# Altium schematic sheet NCS_wireless_display_connc_74hc595.SchDoc
size A
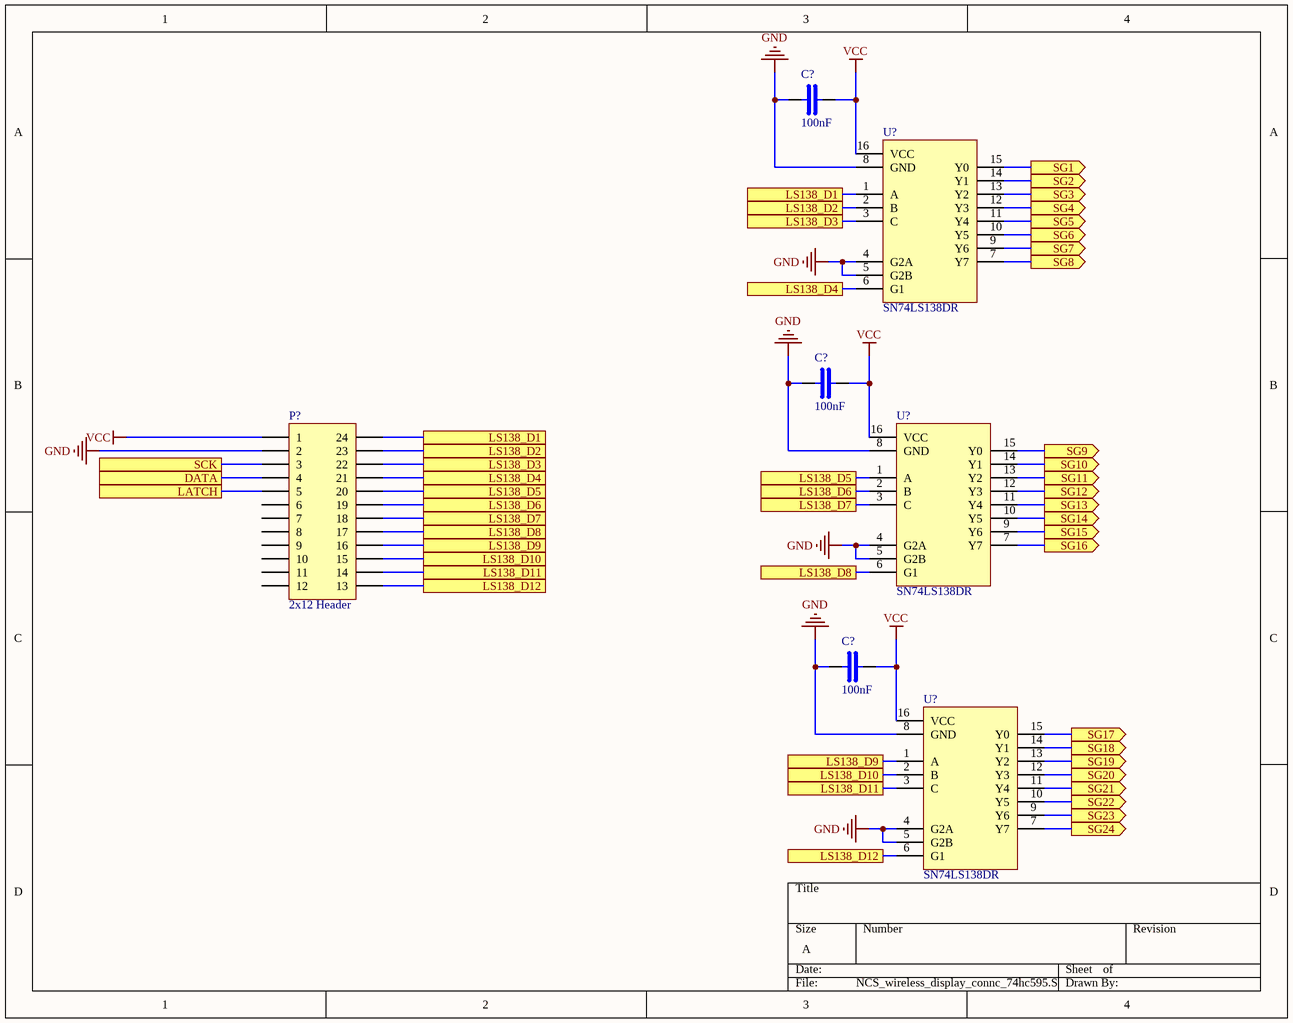
[diagram p0: NCS_wireless_display_connc_74hc595.SchDoc]

## Parts
(Parts that share a designator on the sheet are numbered #1, #2 ... from top to bottom, then left to right.)
C?#1  100nF  [C0805C104K3RACTU_100nF]
C?#2  100nF  [C0805C104K3RACTU_100nF]
C?#3  100nF  [C0805C104K3RACTU_100nF]
P?  2x12 Header  [2x12 header]
U?#1  SN74LS138DR  [SN74LS138DR_SOIC16]
U?#2  SN74LS138DR  [SN74LS138DR_SOIC16]
U?#3  SN74LS138DR  [SN74LS138DR_SOIC16]

## Ports
DATA, LATCH, LS138_D1, LS138_D2, LS138_D3, LS138_D4, LS138_D5, LS138_D6, LS138_D7, LS138_D8, LS138_D9, LS138_D10, LS138_D11, LS138_D12, SCK, SG1 (out), SG2 (out), SG3 (out), SG4 (out), SG5 (out), SG6 (out), SG7 (out), SG8 (out), SG9 (out), SG10 (out), SG11 (out), SG12 (out), SG13 (out), SG14 (out), SG15 (out), SG16 (out), SG17 (out), SG18 (out), SG19 (out), SG20 (out), SG21 (out), SG22 (out), SG23 (out), SG24 (out)

## Nets
GND: C?#1.1 C?#2.1 C?#3.1 P?.2 U?#1.4(G2A) U?#1.5(G2B) U?#1.8(GND) U?#2.4(G2A) U?#2.5(G2B) U?#2.8(GND) U?#3.4(G2A) U?#3.5(G2B) U?#3.8(GND)
VCC: C?#1.2 C?#2.2 C?#3.2 P?.1 U?#1.16(VCC) U?#2.16(VCC) U?#3.16(VCC)
DATA: P?.4 ; port DATA
LATCH: P?.5 ; port LATCH
LS138_D1: P?.24 U?#1.1(A) ; port LS138_D1
LS138_D2: P?.23 U?#1.2(B) ; port LS138_D2
LS138_D3: P?.22 U?#1.3(C) ; port LS138_D3
LS138_D4: P?.21 U?#1.6(G1) ; port LS138_D4
LS138_D5: P?.20 U?#2.1(A) ; port LS138_D5
LS138_D6: P?.19 U?#2.2(B) ; port LS138_D6
LS138_D7: P?.18 U?#2.3(C) ; port LS138_D7
LS138_D8: P?.17 U?#2.6(G1) ; port LS138_D8
LS138_D9: P?.16 U?#3.1(A) ; port LS138_D9
LS138_D10: P?.15 U?#3.2(B) ; port LS138_D10
LS138_D11: P?.14 U?#3.3(C) ; port LS138_D11
LS138_D12: P?.13 U?#3.6(G1) ; port LS138_D12
SCK: P?.3 ; port SCK
SG1: U?#1.15(Y0) ; port SG1
SG2: U?#1.14(Y1) ; port SG2
SG3: U?#1.13(Y2) ; port SG3
SG4: U?#1.12(Y3) ; port SG4
SG5: U?#1.11(Y4) ; port SG5
SG6: U?#1.10(Y5) ; port SG6
SG7: U?#1.9(Y6) ; port SG7
SG8: U?#1.7(Y7) ; port SG8
SG9: U?#2.15(Y0) ; port SG9
SG10: U?#2.14(Y1) ; port SG10
SG11: U?#2.13(Y2) ; port SG11
SG12: U?#2.12(Y3) ; port SG12
SG13: U?#2.11(Y4) ; port SG13
SG14: U?#2.10(Y5) ; port SG14
SG15: U?#2.9(Y6) ; port SG15
SG16: U?#2.7(Y7) ; port SG16
SG17: U?#3.15(Y0) ; port SG17
SG18: U?#3.14(Y1) ; port SG18
SG19: U?#3.13(Y2) ; port SG19
SG20: U?#3.12(Y3) ; port SG20
SG21: U?#3.11(Y4) ; port SG21
SG22: U?#3.10(Y5) ; port SG22
SG23: U?#3.9(Y6) ; port SG23
SG24: U?#3.7(Y7) ; port SG24

Not connected (* = marked no-connect by the designer): P? 6 7 8 9 10 11 12

## Library data of the parts
C?#1-C?#3 = C0805C104K3RACTU: Multilayer Ceramic Capacitor, 0.1 uF, 25 V, ï¿½ 10%, X7R, 0805 [2012 Metric]; Manufacturer: KEMET; Material: 4241ConductorMaterial; Voltage Rating: 25V; Temperature Coefficient: 30ppm/°C; Supplier: Mouser; Supplier Part Number: 80-C0805C104K3R; Manufacturer Part Number: C0805C104K3RACTU; RoHS: Yes; Category: Ceramic Capacitors; Stock: 259681; Pricing: 1=0.1, 10=0.03, 50=0.03, 100=0.027, 1000=0.021, 10000=0.015 (USD); Mounting Technology: Surface Mount,PCB; Case/Package: 0805; Pins: 2NUMBER; Case Code (Imperial): 0805; Case Code (Metric): 2012; Min Operating Temperature: -55°C; Max Operating Temperature: 125°C; Packaging: Tape and Reel; Tolerance: 10%; Value: 100nF; Dielectric: X7R; Termination: SMD/SMT; Package Quantity: 4000; Series: SMD Comm X7R; Voltage Rating (DC): 25V; Construction: Flat; Length: 2mm; Width: 1.2mm; Height: 0.9mm; Depth: 1.25mm; Lead Pitch: 0.75mm; Thickness: 889um; Radiation Hardening: No; RoHS Compliant: Yes; Lead Free: 5697LeadFree; Reach SVHC Compliant: 4186SVHC; ComponentLink1URL: https://datasheet.ciiva.com/7842/kem-c1002-x7r-smd-7842536.pdf?src-supplier=Element14; ComponentLink1Description: https://datasheet.ciiva.com/7842/kem-c1002-x7r-smd-7842536.pdf?src-supplier=Element14; ComponentLink2URL: https://datasheet.ciiva.com/7842/kem-c1002-x7r-smd-7842538.pdf?src-supplier=Element14; ComponentLink2Description: https://datasheet.ciiva.com/7842/kem-c1002-x7r-smd-7842538.pdf?src-supplier=Element14
P? = 0702462401: 2.54mm Pitch C-Grid Header Low Profile Dual Row Vertical Shrouded 24 Circuits 0.38; Manufacturer: Molex; Supplier: Mouser; Supplier Part Number: 538-70246-2401; Manufacturer Part Number: 0702462401; RoHS: Yes; Stock: 1024; Pricing: 1=2.2, 10=1.67, 50=1.67, 100=1.31, 1000=1.31, 10000=1.29 (USD); ComponentLink1URL: https://datasheet.ciiva.com/9470/0702462401-pcb-headers-9470294.pdf?src-supplier=Avnet; ComponentLink1Description: https://datasheet.ciiva.com/9470/0702462401-pcb-headers-9470294.pdf?src-supplier=Avnet
U?#1-U?#3 = SN74LS138DR: 3-line to 8-line decoder / demultiplexer 16-SOIC 0 to 70; Manufacturer: Texas Instruments; Supplier: Mouser; Supplier Part Number: 595-SN74LS138DR; Manufacturer Part Number: SN74LS138DR; RoHS: Yes; Category: Logic ICs; Stock: 4138; Pricing: 1=0.53, 10=0.378, 50=0.378, 100=0.314, 1000=0.303, 10000=0.288 (USD); ComponentLink1URL: https://datasheet.ciiva.com/15092/getdatasheetpartid-251217-15092376.pdf?src-supplier=Verical; ComponentLink1Description: https://datasheet.ciiva.com/15092/getdatasheetpartid-251217-15092376.pdf?src-supplier=Verical; ComponentLink2URL: https://datasheet.ciiva.com/14293/sn54ls138-sp-14293534.pdf?src-supplier=Avnet; ComponentLink2Description: https://datasheet.ciiva.com/14293/sn54ls138-sp-14293534.pdf?src-supplier=Avnet